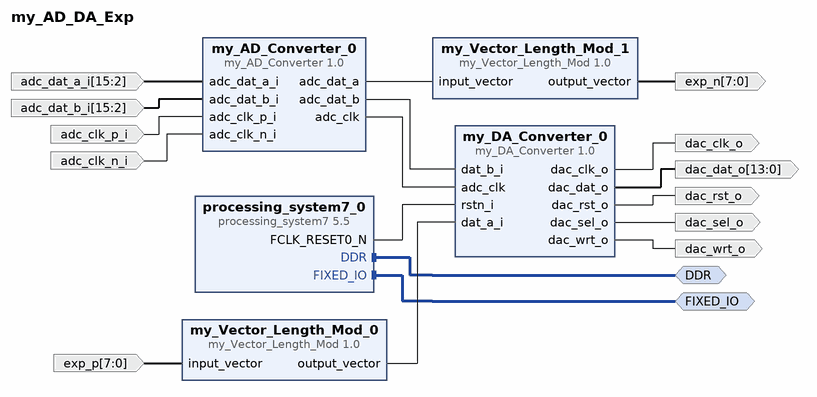
[diagram p0: block diagram of the top level]
# Vivado block design my_AD_DA_Exp, xc7z010clg400-1, Vivado 2018.2
create_bd_design my_AD_DA_Exp

create_bd_intf_port -mode Master -vlnv xilinx.com:interface:ddrx_rtl:1.0 DDR
create_bd_intf_port -mode Master -vlnv xilinx.com:display_processing_system7:fixedio_rtl:1.0 FIXED_IO
create_bd_port -dir I -from 15 -to 2 adc_dat_a_i
create_bd_port -dir I -from 15 -to 2 adc_dat_b_i
create_bd_port -dir I adc_clk_p_i
create_bd_port -dir I adc_clk_n_i
create_bd_port -dir O -from 13 -to 0 dac_dat_o
create_bd_port -dir O dac_wrt_o
create_bd_port -dir O dac_sel_o
create_bd_port -dir O dac_clk_o
create_bd_port -dir O dac_rst_o
create_bd_port -dir I -from 7 -to 0 exp_p
create_bd_port -dir O -from 7 -to 0 exp_n

create_bd_cell -type ip -vlnv xilinx.com:ip:processing_system7:5.5 processing_system7_0
set_property -dict {CONFIG.PCW_USE_M_AXI_GP0 0 CONFIG.PCW_EN_CLK0_PORT 0} [get_bd_cells processing_system7_0]
# 28 more settings of processing_system7_0 are not shown: defaults, MIO pin electricals, DDR timing, and values the tool derives
create_bd_cell -type ip -vlnv user.org:user:my_AD_Converter:1.0 my_AD_Converter_0
create_bd_cell -type ip -vlnv user.org:user:my_DA_Converter:1.0 my_DA_Converter_0
create_bd_cell -type ip -vlnv user.org:user:my_Vector_Length_Mod:1.0 my_Vector_Length_Mod_0
set_property -dict {CONFIG.INPUT_LENGTH 8 CONFIG.OUTPUT_LENGTH 16} [get_bd_cells my_Vector_Length_Mod_0]
create_bd_cell -type ip -vlnv user.org:user:my_Vector_Length_Mod:1.0 my_Vector_Length_Mod_1
set_property -dict {CONFIG.OUTPUT_LENGTH 8} [get_bd_cells my_Vector_Length_Mod_1]

# ---- connections ----

connect_bd_intf_net [get_bd_intf_ports DDR] [get_bd_intf_pins processing_system7_0/DDR]
connect_bd_intf_net [get_bd_intf_ports FIXED_IO] [get_bd_intf_pins processing_system7_0/FIXED_IO]
connect_bd_net [get_bd_pins processing_system7_0/FCLK_RESET0_N] [get_bd_pins my_DA_Converter_0/rstn_i]
connect_bd_net -net adc_dat_a_i_0_1 [get_bd_ports adc_dat_a_i] [get_bd_pins my_AD_Converter_0/adc_dat_a_i]
connect_bd_net -net adc_dat_b_i_0_1 [get_bd_ports adc_dat_b_i] [get_bd_pins my_AD_Converter_0/adc_dat_b_i]
connect_bd_net -net adc_clk_p_i_0_1 [get_bd_ports adc_clk_p_i] [get_bd_pins my_AD_Converter_0/adc_clk_p_i]
connect_bd_net -net adc_clk_n_i_0_1 [get_bd_ports adc_clk_n_i] [get_bd_pins my_AD_Converter_0/adc_clk_n_i]
connect_bd_net [get_bd_pins my_DA_Converter_0/dac_dat_o] [get_bd_ports dac_dat_o]
connect_bd_net [get_bd_pins my_DA_Converter_0/dac_wrt_o] [get_bd_ports dac_wrt_o]
connect_bd_net [get_bd_pins my_DA_Converter_0/dac_sel_o] [get_bd_ports dac_sel_o]
connect_bd_net [get_bd_pins my_DA_Converter_0/dac_clk_o] [get_bd_ports dac_clk_o]
connect_bd_net [get_bd_pins my_DA_Converter_0/dac_rst_o] [get_bd_ports dac_rst_o]
connect_bd_net [get_bd_pins my_AD_Converter_0/adc_dat_b] [get_bd_pins my_DA_Converter_0/dat_b_i]
connect_bd_net [get_bd_pins my_AD_Converter_0/adc_clk] [get_bd_pins my_DA_Converter_0/adc_clk]
connect_bd_net -net input_vector_0_1 [get_bd_ports exp_p] [get_bd_pins my_Vector_Length_Mod_0/input_vector]
connect_bd_net [get_bd_pins my_Vector_Length_Mod_1/output_vector] [get_bd_ports exp_n]
connect_bd_net [get_bd_pins my_AD_Converter_0/adc_dat_a] [get_bd_pins my_Vector_Length_Mod_1/input_vector]
connect_bd_net [get_bd_pins my_Vector_Length_Mod_0/output_vector] [get_bd_pins my_DA_Converter_0/dat_a_i]

validate_bd_design
save_bd_design
